# Altium project ha_sensor.PrjPcb
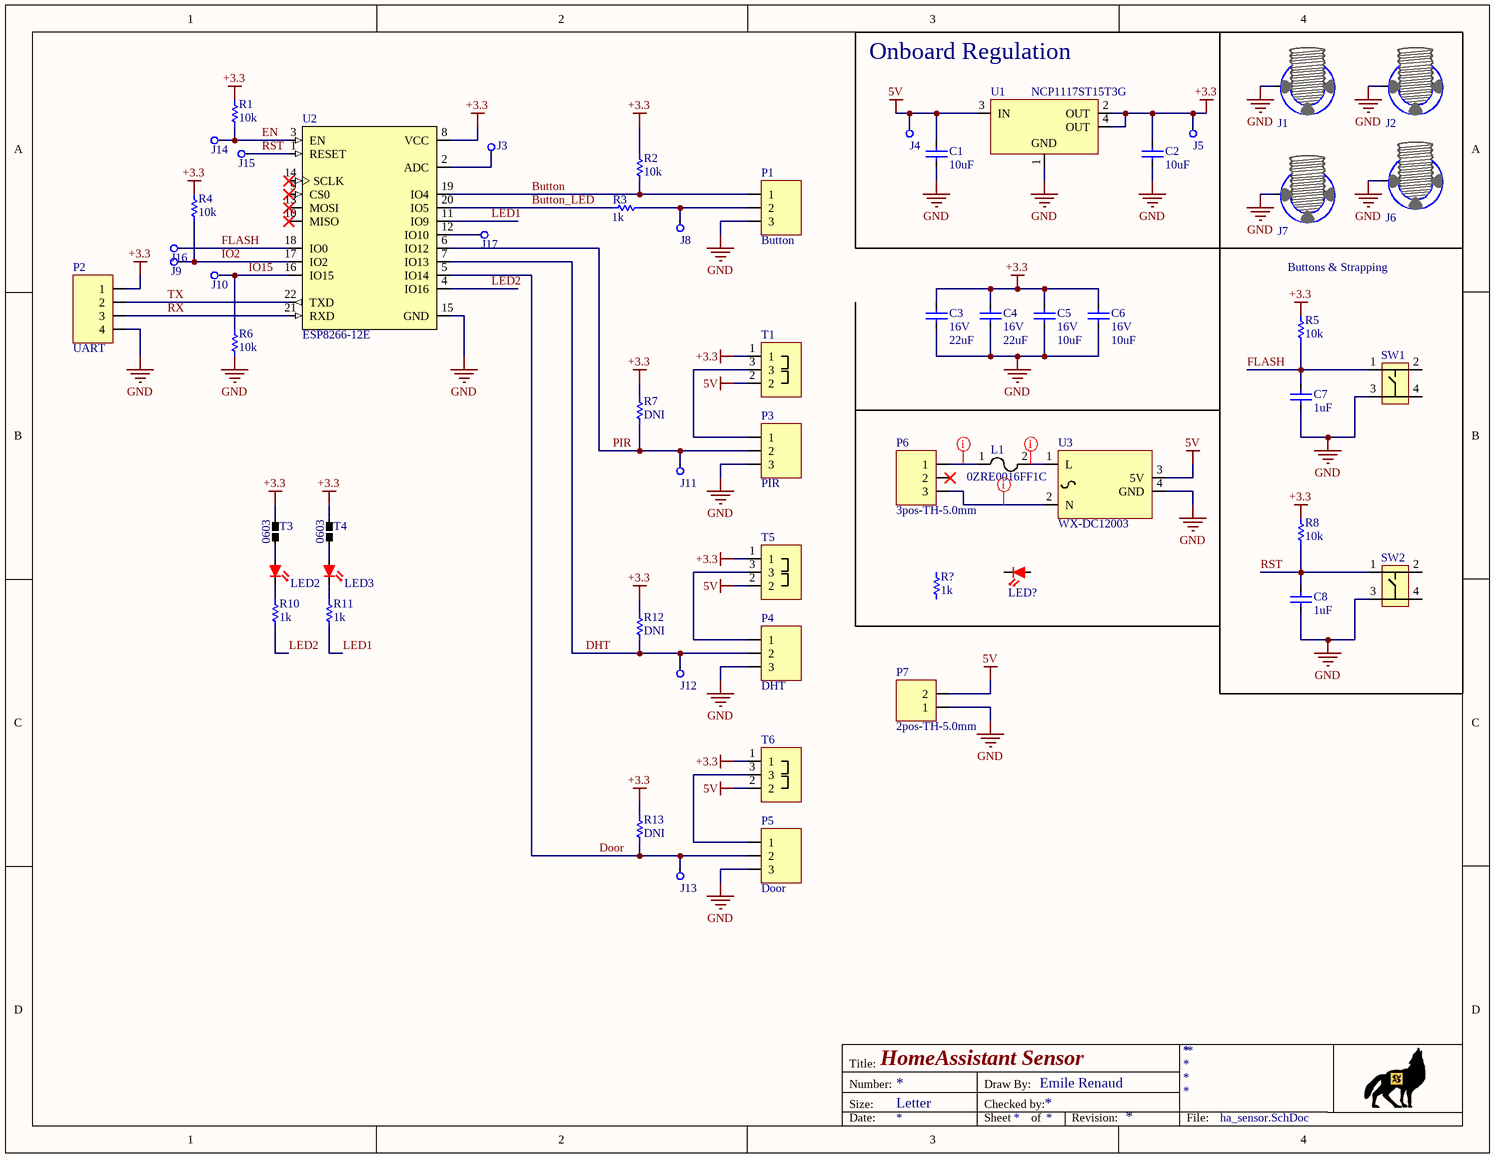
[diagram p0: ha_sensor.SchDoc]
1 sheet, 59 parts. Net scope: global (net labels, ports and power ports of the same name join across sheets).
Board file: ha_sensor.PcbDoc

## Sheet ha_sensor.SchDoc: HomeAssistant Sensor
size Letter; DrawnBy: Emile Renaud

### Parts
C1  value 10uF  [CAPACITOR-0805]  (hidden comment: Capacitor-0805-10uF-35V-X5R)
C2  value 10uF  [CAPACITOR-0805]  (hidden comment: Capacitor-0805-10uF-35V-X5R)
C3  value 22uF  Volt: 16V  [CAPACITOR-0805]  (hidden comment: Capacitor-0805-22uF-16V-X5R)
C4  value 22uF  Volt: 16V  [CAPACITOR-0805]  (hidden comment: Capacitor-0805-22uF-16V-X5R)
C5  value 10uF  Volt: 16V  [CAPACITOR-0805]  (hidden comment: Capacitor-0805-10uF-16V-X5R)
C6  value 10uF  Volt: 16V  [CAPACITOR-0805]  (hidden comment: Capacitor-0805-10uF-16V-X5R)
C7  value 1uF  [CAPACITOR-0603]  (hidden comment: Capacitor-0603-1uF-25V-X5R)
C8  value 1uF  [CAPACITOR-0603]  (hidden comment: Capacitor-0603-1uF-25V-X5R)
J1  hole  [HOLE-3.40MM-M3-7MMEYELET-MountingFeature]  (value not drawn)  (no BOM)
J2  hole  [HOLE-3.40MM-M3-7MMEYELET-MountingFeature]  (value not drawn)  (no BOM)
J3  hole  [PAD-0.53MM]  (value not drawn)  (no BOM)
J4  hole  [PAD-0.53MM]  (value not drawn)  (no BOM)
J5  hole  [PAD-0.53MM]  (value not drawn)  (no BOM)
J6  hole  [HOLE-3.40MM-M3-7MMEYELET-MountingFeature]  (value not drawn)  (no BOM)
J7  hole  [HOLE-3.40MM-M3-7MMEYELET-MountingFeature]  (value not drawn)  (no BOM)
J8  hole  [PAD-0.53MM]  (value not drawn)  (no BOM)
J9  hole  [PAD-0.53MM]  (value not drawn)  (no BOM)
J10  hole  [PAD-0.53MM]  (value not drawn)  (no BOM)
J11  hole  [PAD-0.53MM]  (value not drawn)  (no BOM)
J12  hole  [PAD-0.53MM]  (value not drawn)  (no BOM)
J13  hole  [PAD-0.53MM]  (value not drawn)  (no BOM)
J14  hole  [PAD-0.53MM]  (value not drawn)  (no BOM)
J15  hole  [PAD-0.53MM]  (value not drawn)  (no BOM)
J16  hole  [PAD-0.53MM]  (value not drawn)  (no BOM)
J17  hole  [PAD-0.53MM]  (value not drawn)  (no BOM)
L1  0ZRE0016FF1C  [0ZRE0016FF1C-PTC]
LED2  B1911USD-20D000114U1930  [LED-0603-2PIN]  (value not drawn)
LED3  B1911USD-20D000114U1930  [LED-0603-2PIN]  (value not drawn)
LED?  B1911USD-20D000114U1930  [LED-0603-2PIN]  (value not drawn)
P1  Button  [JST_XH_3_Pos]
P2  UART  [HDR1X4]
P3  PIR  [JST_XH_3_Pos]
P4  DHT  [JST_XH_3_Pos]
P5  Door  [JST_XH_3_Pos]
P6  3pos-TH-5.0mm  [Weco 3]
P7  2pos-TH-5.0mm  [Weco 2]
R1  value 10k  [Resistor-0603]  (hidden comment: SMT resistor)
R2  value 10k  [Resistor-0603]  (hidden comment: SMT resistor)
R3  value 1k  [Resistor-0603]  (hidden comment: SMT resistor)
R4  value 10k  [Resistor-0603]  (hidden comment: SMT resistor)
R5  value 10k  [Resistor-0603]  (hidden comment: SMT resistor)
R6  value 10k  [Resistor-0603]  (hidden comment: SMT resistor)
R7  value DNI  [Resistor-0603]  (hidden comment: SMT resistor)
R8  value 10k  [Resistor-0603]  (hidden comment: SMT resistor)
R10  value 1k  [Resistor-0603]  (hidden comment: SMT resistor)
R11  value 1k  [Resistor-0603]  (hidden comment: SMT resistor)
R12  value DNI  [Resistor-0603]  (hidden comment: SMT resistor)
R13  value DNI  [Resistor-0603]  (hidden comment: SMT resistor)
R?  value 1k  [Resistor-0603]  (hidden comment: SMT resistor)
SW1  PTS815 SJM 250 SMTR LFS  [SW4_PTS815 SJM 250 SMTR LFS_CNK]  (value not drawn)
SW2  PTS815 SJM 250 SMTR LFS  [SW4_PTS815 SJM 250 SMTR LFS_CNK]  (value not drawn)
T1  Jumper-3pos-small  [Jumper-3pos-small]  (value not drawn)
T3  NetTie_0603_Short  [NetTie-0603-short]  (value not drawn)
T4  NetTie_0603_Short  [NetTie-0603-short]  (value not drawn)
T5  Jumper-3pos-small  [Jumper-3pos-small]  (value not drawn)
T6  Jumper-3pos-small  [Jumper-3pos-small]  (value not drawn)
U1  NCP1117ST15T3G  [SOT-223-3/TO-261-3S]
U2  ESP8266-12E  [ESP8266-12E]
U3  WX-DC12003  [WX-DC12003]

### Blocks framed on the sheet
Onboard Regulation: C1 C2 J4 J5 U1

### Nets
5V: C1.2 J4.1 P7.2 T1.2 T5.2 T6.2 U1.3(IN) U3.3(5V)
+3.3: C2.2 C3.2 C4.2 C5.2 C6.2 J5.1 P2.1 R1.2 R2.2 R4.2 R5.2 R7.2 R8.2 R12.2 R13.2 T1.1 T3.1 T4.1 T5.1 T6.1 U1.2(OUT) U1.4(OUT) U2.8(VCC)
GND: C1.1 C2.1 C3.1 C4.1 C5.1 C6.1 C7.1 C8.1 J1.1 J2.1 J6.1 J7.1 P1.3 P2.4 P3.3 P4.3 P5.3 P7.1 R6.1 SW1.3 SW2.3 U1.1(GND) U2.15(GND) U3.4(GND)
Button: P1.1 R2.1 U2.19(IO4)
Button_LED: R3.2 U2.20(IO5)
DHT: J12.1 P4.2 R12.1 U2.7(IO13)
Door: J13.1 P5.2 R13.1 U2.5(IO14)
EN: J14.1 R1.1 U2.3(EN)
FLASH: C7.2 J16.1 R5.1 SW1.1 U2.18(IO0)
IO2: J9.1 R4.1 U2.17(IO2)
IO15: J10.1 R6.2 U2.16(IO15)
LED1: R11.1 U2.11(IO9)
LED2: R10.1 U2.4(IO16)
PIR: J11.1 P3.2 R7.1 U2.6(IO12)
RST: C8.2 J15.1 R8.1 SW2.1 U2.1(RESET)
RX: P2.3 U2.21(RXD)
TX: P2.2 U2.22(TXD)
NetJ3_1: J3.1 U2.2(ADC)
NetJ8_1: J8.1 P1.2 R3.1
NetJ17_1: J17.1 U2.12(IO10)
NetL1_1: L1.1 P6.1
NetL1_2: L1.2 U3.1(L)
NetLED2_1: LED2.1(K) R10.2
NetLED2_2: LED2.2(R) T3.2
NetLED3_1: LED3.1(K) R11.2
NetLED3_2: LED3.2(R) T4.2
NetP3_1: P3.1 T1.3
NetP4_1: P4.1 T5.3
NetP5_1: P5.1 T6.3
NetP6_3: P6.3 U3.2(N)

Not connected (* = marked no-connect by the designer): LED? 1(K) 2(R); P6 2*; R? 1 2; SW1 2 4; SW2 2 4; U2 9(CS0)* 10(MISO)* 13(MOSI)* 14(SCLK)*

### Layout directives
net class AC: NetL1_1, NetL1_2, NetP6_3

### Notes on the sheet
- (near R5) Buttons & Strapping
- Title:
- Size:
- Number:
- Letter
- Draw By:
- Checked by:
- Date:
- Sheet
- of
- Revision:
- File:
- (in symbol NetTie_0603_Short) 0603

### Library data of the parts
C1 C2 = Capacitor-0805-10uF-35V-X5R: Precision: X5R-10%; Volt: 35V; Package / Case: Metric 2012 , EIA 0805; Mounted: Yes; Supplier 1: Digi-Key; Supplier Part Number 1: 490-10515-1-ND; Supplier 2: Digi-Key; Supplier 3: Digi-Key; Supplier 4: Digi-Key
C3 C4 = Capacitor-0805-22uF-16V-X5R: Precision: X5R-10%; Package / Case: Metric 2012 , EIA 0805; Mounted: Yes; Supplier 1: Digi-Key; Supplier Part Number 1: 1276-6780-1-ND; Supplier 2: Digi-Key
C5 C6 = Capacitor-0805-10uF-16V-X5R: Precision: X5R-10%; Package / Case: Metric 2012 , EIA 0805; Mounted: Yes; Supplier 1: Digi-Key; Supplier Part Number 1: 1276-1096-2-ND; Supplier 2: Digi-Key
C7 C8 = Capacitor-0603-1uF-25V-X5R: Precision: X5R-10%; Volt: 25V; Package / Case: Metric 1608, EIA 0603; Mounted: Yes; Supplier 1: Digi-Key; Supplier Part Number 1: 1276-1859-2-ND; Supplier 2: Digi-Key; Supplier 3: Digi-Key; Supplier 4: Digi-Key; Supplier Part Number 2: 1276-1942-2-ND
J1 J2 J6 J7 = Hole 3.40mm M3-MountingFeature: Hole for M3 Bolt with 7mm pad; Mounted: N/A
J3-J5 J8-J17 = PAD 0.53mm AWG28-Solid: PAD for 28 AWG Solid Wire; Mounted: N/A
L1 = 0ZRE0016FF1C: PTC RESET FUSE 240V 160MA RADIAL; Current: 5A; Precision: 20%; Supplier 1: Digi-Key; Mounted: Yes; Supplier Part Number 1: 308-2498-1-ND; Package / Case: SMD
LED2 LED3 LED? = B1911USD-20D000114U1930: LED RED CLEAR 0603 SMD; Package / Case: 0603 (1608 Metric); Mounted: Yes; Supplier 1: Digi-Key; Supplier Part Number 1: 3147-B1911USD-20D000114U1930CT-ND
P1 P3-P5 = JST_XH_3_Pos: CONN HEADER VERT 3POS 2.5MM; Supplier 1: Digi-Key; Supplier Part Number 1: 455-2248-ND; Mounted: Yes; Package / Case: TH; Volt: N/A
P2 = 4pos-TH-2.54mm: 4pos TH 2.54mm Header; Supplier 1: Digi-Key; Supplier Part Number 1: N/A; Mounted: Yes; Package / Case: TH; Volt: N/A
P6 = 3P-TH-5.0mm: 3pos-TH-5.0mm Screw Terminal; Supplier 1: Digi-Key; Supplier Part Number 1: 277-1667-ND; Mounted: Yes; Package / Case: TH; Volt: N/A
P7 = 2P-TH-5.0mm: 2pos-TH-5.0mm Screw Terminal; Supplier 1: Digi-Key; Supplier Part Number 1: N/A277-1667-ND; Mounted: Yes; Package / Case: TH; Volt: N/A
R1 R2 R4 R6 R7 R12 R13 = Resistor-0603-10k: Resistor0603-10k; Precision: 1%; Watt: 0.1W; Mounted: Yes; Package / Case: Metric 1608, EIA 0603; Supplier 1: Digi-Key; Supplier Part Number 1: 311-10.0KHRTR-ND
R3 R10 R11 R? = Resistor-0603-1k: Resistor0603-1k; Precision: 1%; Watt: 0.1W; Mounted: Yes; Package / Case: Metric 1608, EIA 0603; Supplier 1: Digi-Key; Supplier Part Number 1: 311-1.00KHRCT-ND
R5 R8 = Resistor0603-10k: Precision: 1%; Watt: 0.1W; Mounted: Yes; Package / Case: Metric 1608, EIA 0603; Supplier 2: Digi-Key; Supplier 4: Digi-Key; Supplier Part Number 2: RMCF0603FT10K0TR-ND; Supplier 1: Digi-Key; Supplier 3: Digi-Key; Supplier Part Number 1: 311-10.0KHRTR-ND
SW1 SW2 = PTS815 SJM 250 SMTR LFS: TACT 4.2 X 3.2, 2.5 MM H, 180GF,; Volt: 12V; Current: 0.05A; Supplier 1: Digi-Key; Supplier Part Number 1: CKN12215-1-ND; Mounted: Yes
U1 = NCP1117ST15T3G: IC REG LINEAR 3.3V 1A SOT223; Supplier 1: Digi-Key; Supplier Part Number 1: NCV1117ST33T3GOSCT-ND; Package / Case: SOT223; Mounted: Yes
U3 = WX-DC12003: AC/DC Isolated converter. 50-277AC -> 5Vdc; Grade: None; Supplier 1: Aliexpress; Supplier Part Number 1: WX-DC12003; HelpURL: https://www.aerial.net/shop/product/54_250/2321/85265v-ac-to-5v.html
U2 = ESP8266-12E: Value: *